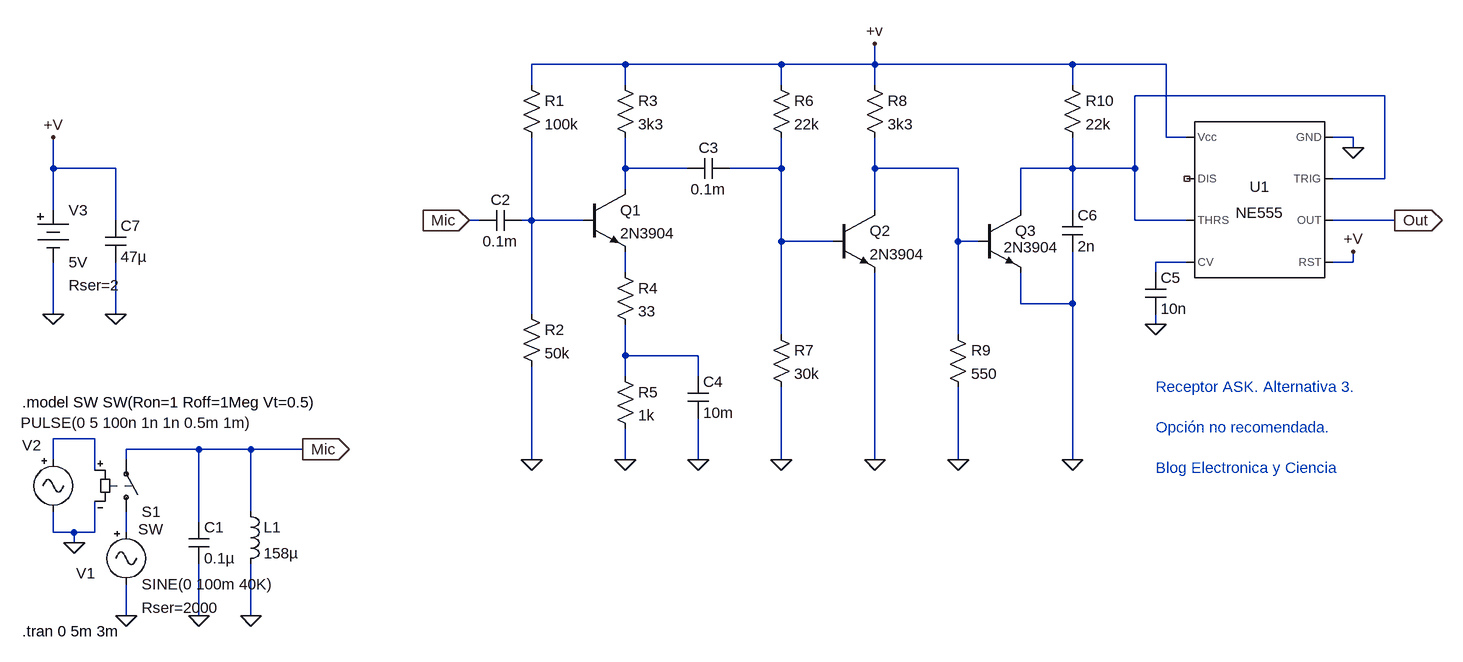
[diagram p0: schematic receiver_digi_alternativa3.asc]
receiver_digi_alternativa3.asc, the LTspice schematic file:
Version 4
SHEET 1 2536 1224
WIRE 944 336 800 336
WIRE 1184 336 944 336
WIRE 1328 336 1328 304
WIRE 1328 336 1184 336
WIRE 1632 336 1328 336
WIRE 1776 336 1632 336
WIRE 800 368 800 336
WIRE 944 368 944 336
WIRE 1184 368 1184 336
WIRE 1328 368 1328 336
WIRE 1632 368 1632 336
WIRE 2112 384 1728 384
WIRE 1776 448 1776 336
WIRE 1808 448 1776 448
WIRE 2064 448 2032 448
WIRE 2064 464 2064 448
WIRE 64 496 64 448
WIRE 160 496 64 496
WIRE 944 496 944 448
WIRE 1040 496 944 496
WIRE 1184 496 1184 448
WIRE 1184 496 1104 496
WIRE 1328 496 1328 448
WIRE 1456 496 1328 496
WIRE 1632 496 1632 448
WIRE 1632 496 1552 496
WIRE 1728 496 1728 384
WIRE 1728 496 1632 496
WIRE 2112 512 2112 384
WIRE 2112 512 2032 512
WIRE 944 528 944 496
WIRE 64 560 64 496
WIRE 1328 560 1328 496
WIRE 1552 560 1552 496
WIRE 1632 560 1632 496
WIRE 160 576 160 496
WIRE 720 576 704 576
WIRE 800 576 800 448
WIRE 800 576 784 576
WIRE 880 576 800 576
WIRE 1728 576 1728 496
WIRE 1808 576 1728 576
WIRE 2128 576 2032 576
WIRE 1184 608 1184 496
WIRE 1264 608 1184 608
WIRE 1456 608 1456 496
WIRE 1488 608 1456 608
WIRE 1808 640 1760 640
WIRE 2064 640 2064 624
WIRE 2064 640 2032 640
WIRE 944 656 944 624
WIRE 1760 656 1760 640
WIRE 1552 704 1552 656
WIRE 1632 704 1632 624
WIRE 1632 704 1552 704
WIRE 64 720 64 640
WIRE 160 720 160 640
WIRE 800 720 800 576
WIRE 1760 736 1760 720
WIRE 1184 752 1184 608
WIRE 1456 752 1456 608
WIRE 944 784 944 736
WIRE 1056 784 944 784
WIRE 944 816 944 784
WIRE 1056 816 1056 784
WIRE 128 912 64 912
WIRE 288 928 176 928
WIRE 368 928 288 928
WIRE 448 928 368 928
WIRE 64 944 64 912
WIRE 176 944 176 928
WIRE 800 944 800 800
WIRE 944 944 944 896
WIRE 1056 944 1056 880
WIRE 1184 944 1184 832
WIRE 1328 944 1328 656
WIRE 1456 944 1456 832
WIRE 1632 944 1632 704
WIRE 128 960 128 912
WIRE 368 1024 368 928
WIRE 288 1040 288 928
WIRE 64 1056 64 1024
WIRE 96 1056 64 1056
WIRE 128 1056 128 1008
WIRE 128 1056 96 1056
WIRE 176 1056 176 1024
WIRE 96 1072 96 1056
WIRE 176 1184 176 1136
WIRE 288 1184 288 1104
WIRE 368 1184 368 1104
FLAG 448 928 Mic
IOPIN 448 928 Out
FLAG 176 1184 0
FLAG 96 1072 0
FLAG 368 1184 0
FLAG 288 1184 0
FLAG 944 944 0
FLAG 1056 944 0
FLAG 800 944 0
FLAG 704 576 Mic
IOPIN 704 576 In
FLAG 64 720 0
FLAG 64 448 +V
FLAG 160 720 0
FLAG 1328 944 0
FLAG 1184 944 0
FLAG 1328 304 +v
FLAG 1632 944 0
FLAG 1456 944 0
FLAG 2064 464 0
FLAG 2128 576 Out
IOPIN 2128 576 Out
FLAG 1760 736 0
FLAG 2064 624 +V
SYMBOL Misc\\signal 176 1040 R0
WINDOW 123 0 0 Left 2
WINDOW 39 24 132 Left 2
WINDOW 0 -77 79 Left 2
SYMATTR SpiceLine Rser=2000
SYMATTR InstName V1
SYMATTR Value SINE(0 100m 40K)
SYMBOL Misc\\signal 64 928 R0
WINDOW 0 -48 -6 Left 2
WINDOW 3 -50 -41 Left 2
WINDOW 123 0 0 Left 2
WINDOW 39 24 132 Left 2
SYMATTR InstName V2
SYMATTR Value PULSE(0 5 100n 1n 1n 0.5m 1m)
SYMBOL sw 176 1040 M180
WINDOW 3 19 -11 Left 2
SYMATTR InstName S1
SYMBOL cap 272 1040 R0
SYMATTR InstName C1
SYMATTR Value 0.1µ
SYMBOL ind 352 1008 R0
SYMATTR InstName L1
SYMATTR Value 158µ
SYMATTR SpiceLine Rser=3
SYMBOL npn 880 528 R0
SYMATTR InstName Q1
SYMATTR Value 2N3904
SYMBOL res 784 352 R0
SYMATTR InstName R1
SYMATTR Value 100k
SYMBOL res 784 704 R0
SYMATTR InstName R2
SYMATTR Value 50k
SYMBOL res 928 352 R0
SYMATTR InstName R3
SYMATTR Value 3k3
SYMBOL res 928 640 R0
SYMATTR InstName R4
SYMATTR Value 33
SYMBOL res 928 800 R0
SYMATTR InstName R5
SYMATTR Value 1k
SYMBOL cap 784 560 R90
WINDOW 0 0 32 VBottom 2
WINDOW 3 32 32 VTop 2
SYMATTR InstName C2
SYMATTR Value 0.1m
SYMBOL cap 1104 480 R90
WINDOW 0 0 32 VBottom 2
WINDOW 3 32 32 VTop 2
SYMATTR InstName C3
SYMATTR Value 0.1m
SYMBOL cap 1040 816 R0
SYMATTR InstName C4
SYMATTR Value 10m
SYMBOL Misc\\battery 64 544 R0
WINDOW 123 0 0 Left 2
WINDOW 39 24 132 Left 2
SYMATTR SpiceLine Rser=2
SYMATTR InstName V3
SYMATTR Value 5V
SYMBOL cap 144 576 R0
SYMATTR InstName C7
SYMATTR Value 47µ
SYMBOL npn 1264 560 R0
SYMATTR InstName Q2
SYMATTR Value 2N3904
SYMBOL res 1168 352 R0
SYMATTR InstName R6
SYMATTR Value 22k
SYMBOL res 1168 736 R0
SYMATTR InstName R7
SYMATTR Value 30k
SYMBOL res 1312 352 R0
SYMATTR InstName R8
SYMATTR Value 3k3
SYMBOL res 1616 352 R0
SYMATTR InstName R10
SYMATTR Value 22k
SYMBOL cap 1616 560 R0
SYMATTR InstName C6
SYMATTR Value 2n
SYMBOL npn 1488 560 R0
WINDOW 3 38 57 Left 2
SYMATTR Value 2N3904
SYMATTR InstName Q3
SYMBOL res 1440 736 R0
SYMATTR InstName R9
SYMATTR Value 550
SYMBOL Misc\\NE555 1920 544 M0
SYMATTR InstName U1
SYMBOL cap 1744 656 R0
SYMATTR InstName C5
SYMATTR Value 10n
TEXT 16 856 Left 2 !.model SW SW(Ron=1 Roff=1Meg Vt=0.5)
TEXT 16 1208 Left 2 !.tran 0 5m 3m
TEXT 1760 832 Left 2 ;Receptor ASK. Alternativa 3.\n \nOpción no recomendada.\n \nBlog Electronica y Ciencia

The netlist it stands for:
* receiver_digi_alternativa3.asc
V1 N010 0 SINE(0 100m 40K) Rser=2000
V2 N009 0 PULSE(0 5 100n 1n 1n 0.5m 1m)
S1 N010 Mic N009 0 SW
C1 Mic 0 0.1µ
L1 Mic 0 158µ Rser=3
Q1 N002 N005 N007 0 2N3904
R1 +V N005 100k
R2 N005 0 50k
R3 +V N002 3k3
R4 N007 N008 33
R5 N008 0 1k
C2 N005 Mic 0.1m
C3 N003 N002 0.1m
C4 N008 0 10m
V3 +V 0 5V Rser=2
C7 +V 0 47µ
Q2 N004 N003 0 0 2N3904
R6 +V N003 22k
R7 N003 0 30k
R8 +V N004 3k3
R10 +V N001 22k
C6 N001 0 2n
Q3 N001 N004 0 0 2N3904
R9 N004 0 550
XU1 0 N001 Out +V N006 N001 NC_01 +V NE555  ; pins GND TRIG OUT RST CV THRS DIS Vcc
C5 N006 0 10n
.model NPN NPN
.model PNP PNP
.lib standard.bjt
.model SW SW(Ron=1 Roff=1Meg Vt=0.5)
.tran 0 5m 3m
* Receptor ASK. Alternativa 3.
* Opción no recomendada.
* Blog Electronica y Ciencia
.lib NE555.sub
.backanno
.end